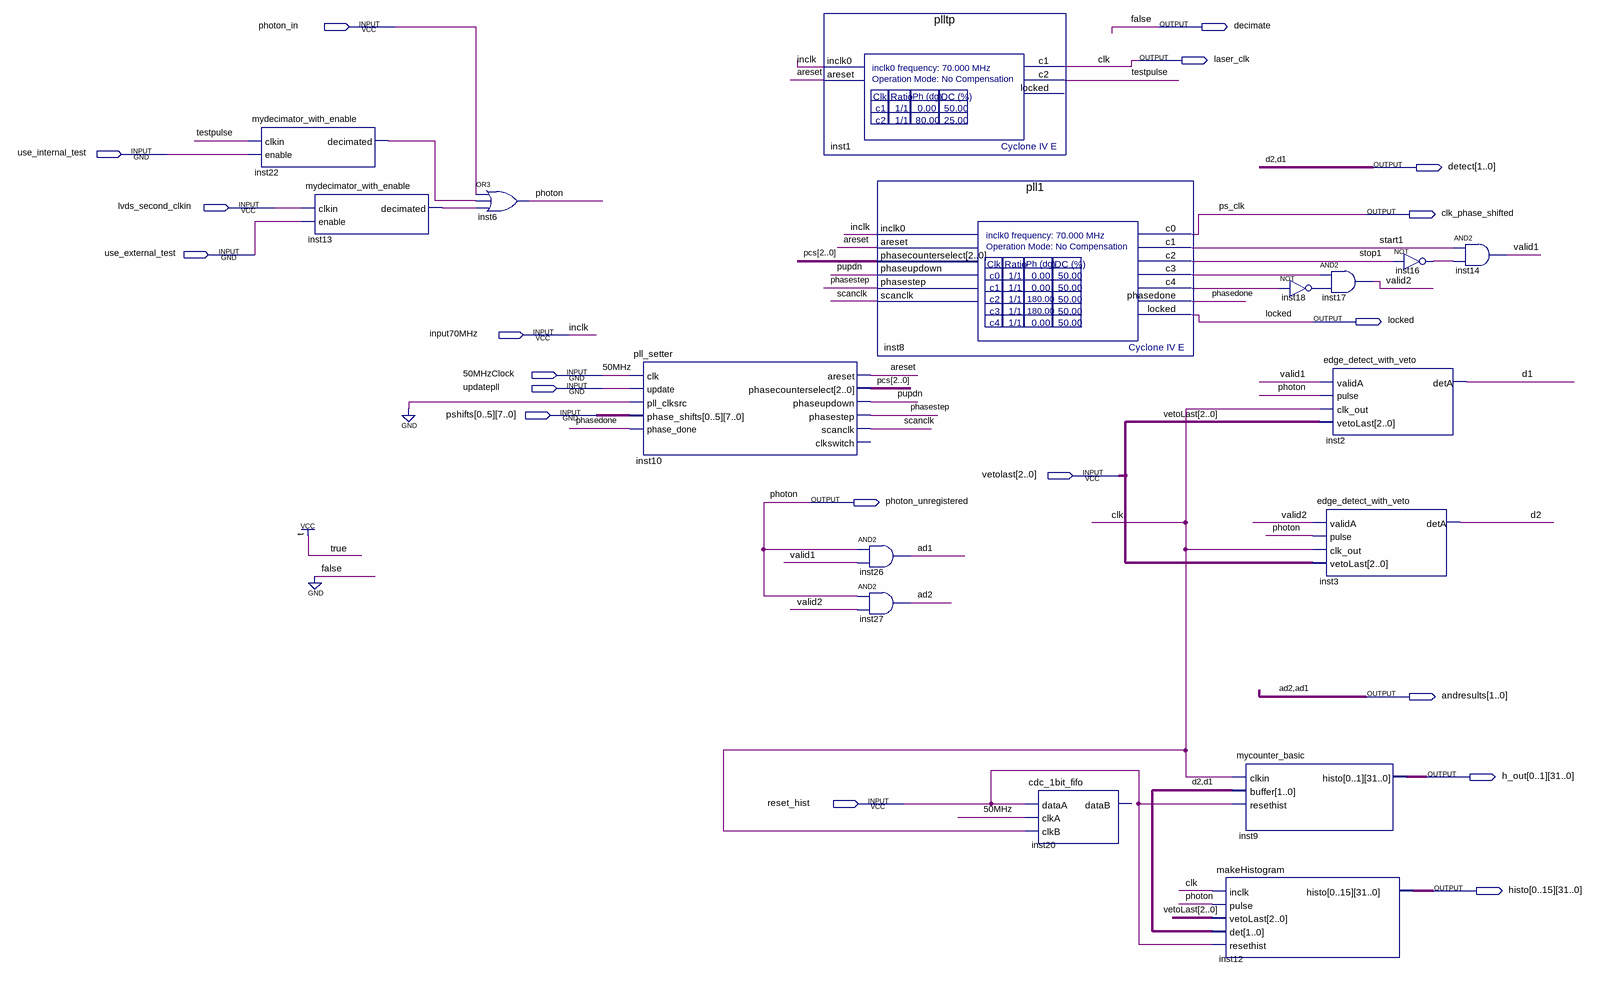
[diagram p0: schematic sheet]
// Quartus schematic plls_and_photons.bdf as structural Verilog: 17 symbols, 19 pins
module plls_and_photons (
  input  photon_in,
  input  use_internal_test,
  input  lvds_second_clkin,
  input  use_external_test,
  input  input70MHz,
  input  \50MHzClock ,
  input  updatepll,
  input  [7:0] pshifts_0,
  input  [7:0] pshifts_1,
  input  [7:0] pshifts_2,
  input  [7:0] pshifts_3,
  input  [7:0] pshifts_4,
  input  [7:0] pshifts_5,
  input  [2:0] vetolast,
  input  reset_hist,
  output decimate,
  output laser_clk,
  output [1:0] detect,
  output clk_phase_shifted,
  output locked,
  output photon_unregistered,
  output [1:0] andresults,
  output [31:0] h_out_0,
  output [31:0] h_out_1,
  output [31:0] histo_0,
  output [31:0] histo_1,
  output [31:0] histo_2,
  output [31:0] histo_3,
  output [31:0] histo_4,
  output [31:0] histo_5,
  output [31:0] histo_6,
  output [31:0] histo_7,
  output [31:0] histo_8,
  output [31:0] histo_9,
  output [31:0] histo_10,
  output [31:0] histo_11,
  output [31:0] histo_12,
  output [31:0] histo_13,
  output [31:0] histo_14,
  output [31:0] histo_15
);

  wire areset, inst8_c3, inst8_c4, inst13_decimated, inst16_out, inst18_out, inst22_decimated, phasedone,
       phasestep, pupdn, scanclk, start1, stop1, testpulse, valid1, valid2;
  wire [2:0] pcs;

  mydecimator_with_enable inst22 (.clkin(testpulse), .enable(use_internal_test), .decimated(inst22_decimated));
  mydecimator_with_enable inst13 (.clkin(lvds_second_clkin), .enable(use_external_test), .decimated(inst13_decimated));
  or inst6 (photon_unregistered, photon_in, inst22_decimated, inst13_decimated);
  pll_setter inst10 (
    .clk(\50MHzClock ), .update(updatepll), .pll_clksrc(1'b0),
    .phase_shifts({pshifts_0, pshifts_1, pshifts_2, pshifts_3, pshifts_4, pshifts_5}),
    .phase_done(phasedone), .areset(areset), .phasecounterselect(pcs), .phaseupdown(pupdn),
    .phasestep(phasestep), .scanclk(scanclk));  // open: clkswitch
  plltp inst1 (.inclk0(input70MHz), .areset(areset), .c1(laser_clk), .c2(testpulse));  // open: locked
  pll1 inst8 (
    .inclk0(input70MHz), .areset(areset), .phasecounterselect(pcs), .phaseupdown(pupdn),
    .phasestep(phasestep), .scanclk(scanclk), .c0(clk_phase_shifted), .c1(start1), .c2(stop1), .c3(inst8_c3),
    .c4(inst8_c4), .phasedone(phasedone), .locked(locked));
  and inst26 (andresults[0], photon_unregistered, valid1);
  and inst27 (andresults[1], photon_unregistered, valid2);
  cdc_1bit_fifo inst20 (.dataA(reset_hist), .clkA(\50MHzClock ), .clkB(laser_clk));  // open: dataB
  mycounter_basic inst9 (.clkin(laser_clk), .buffer(detect), .resethist(reset_hist), .histo({h_out_0, h_out_1}));
  makeHistogram inst12 (
    .inclk(laser_clk), .pulse(photon_unregistered), .vetoLast(vetolast), .det(detect),
    .resethist(reset_hist),
    .histo({histo_0, histo_1, histo_2, histo_3, histo_4, histo_5, histo_6, histo_7, histo_8, histo_9, histo_10, histo_11, histo_12, histo_13, histo_14, histo_15}));
  not inst18 (inst18_out, inst8_c4);
  and inst17 (valid2, inst8_c3, inst18_out);
  edge_detect_with_veto inst2 (
    .validA(valid1), .pulse(photon_unregistered), .clk_out(laser_clk), .vetoLast(vetolast), .detA(detect[0]));
  edge_detect_with_veto inst3 (
    .validA(valid2), .pulse(photon_unregistered), .clk_out(laser_clk), .vetoLast(vetolast), .detA(detect[1]));
  not inst16 (inst16_out, stop1);
  and inst14 (valid1, start1, inst16_out);

  assign decimate = 1'b0;

  // Other names for the same wires on the sheet: 50MHz = \50MHzClock ; ad1 = andresults[0]; ad2 = andresults[1];
  //   clk = laser_clk; d1 = detect[0]; d2 = detect[1]; inclk = input70MHz; photon = photon_unregistered;
  //   ps_clk = clk_phase_shifted
endmodule
